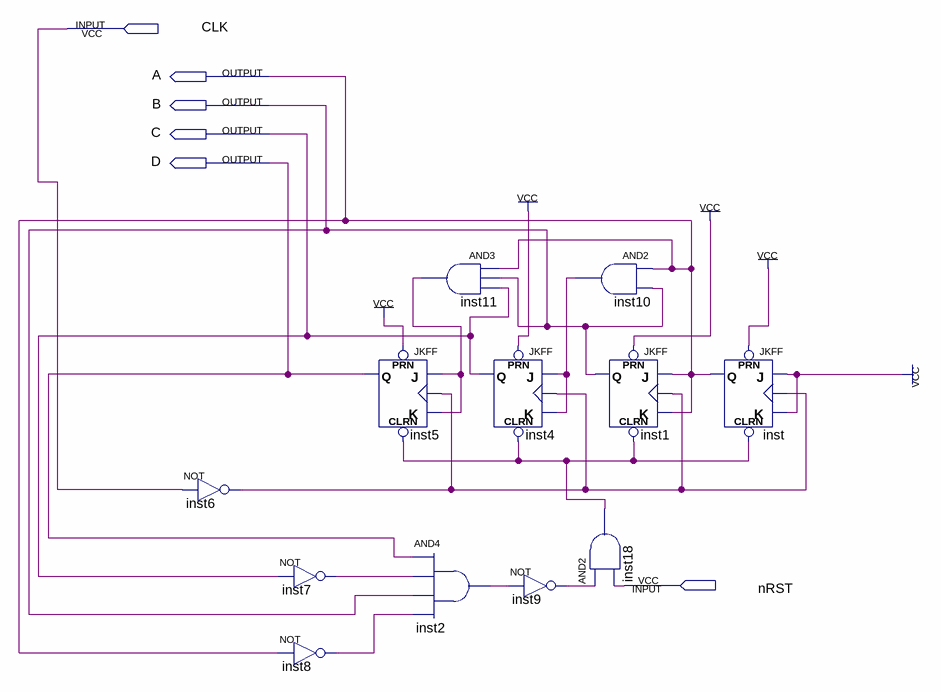
[diagram p0: schematic sheet]
// Quartus schematic contadorMod10.bdf as structural Verilog: 12 symbols, 6 pins
module contadorMod10 (
  input  CLK,
  input  nRST,
  output A,
  output B,
  output C,
  output D
);

  wire inst2_out, inst6_out, inst7_out, inst8_out, inst9_out, inst10_out, inst11_out, inst18_out;

  not inst6 (inst6_out, CLK);
  not inst7 (inst7_out, C);
  not inst8 (inst8_out, A);
  JKFF inst5 (.PRN(1'b1), .CLRN(inst18_out), .K(inst11_out), .J(inst11_out), .CLK(inst6_out), .Q(D));
  and inst11 (inst11_out, A, B, C);
  and inst2 (inst2_out, D, inst7_out, B, inst8_out);
  JKFF inst4 (.PRN(1'b1), .CLRN(inst18_out), .K(inst10_out), .J(inst10_out), .CLK(inst6_out), .Q(C));
  not inst9 (inst9_out, inst2_out);
  and inst10 (inst10_out, A, B);
  JKFF inst1 (.PRN(1'b1), .CLRN(inst18_out), .K(A), .J(A), .CLK(inst6_out), .Q(B));
  and inst18 (inst18_out, inst9_out, nRST);
  JKFF inst (.PRN(1'b1), .CLRN(inst18_out), .K(1'b1), .J(1'b1), .CLK(inst6_out), .Q(A));
endmodule
